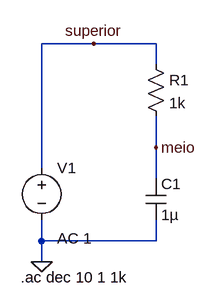
[diagram p0: schematic exemplo 1.asc]
exemplo 1.asc, the LTspice schematic file:
Version 4
SHEET 1 880 680
WIRE 160 -80 80 -80
WIRE 256 -80 160 -80
WIRE 256 -48 256 -80
WIRE 256 80 256 32
WIRE 80 112 80 -80
WIRE 256 128 256 80
WIRE 80 224 80 192
WIRE 256 224 256 192
WIRE 256 224 80 224
WIRE 80 256 80 224
FLAG 80 256 0
FLAG 160 -80 superior
FLAG 256 80 meio
SYMBOL voltage 80 96 R0
WINDOW 123 24 124 Left 2
WINDOW 39 0 0 Left 2
SYMATTR Value2 AC 1
SYMATTR InstName V1
SYMATTR Value ""
SYMBOL res 240 -64 R0
SYMATTR InstName R1
SYMATTR Value 1k
SYMBOL cap 240 128 R0
SYMATTR InstName C1
SYMATTR Value 1µ
TEXT 48 280 Left 2 !.ac dec 10 1 1k

The netlist it stands for:
* exemplo 1.asc
V1 superior 0 AC 1
R1 superior meio 1k
C1 meio 0 1µ
.ac dec 10 1 1k
.backanno
.end

* Results of the author's LTspice run, read from the files saved beside the schematic
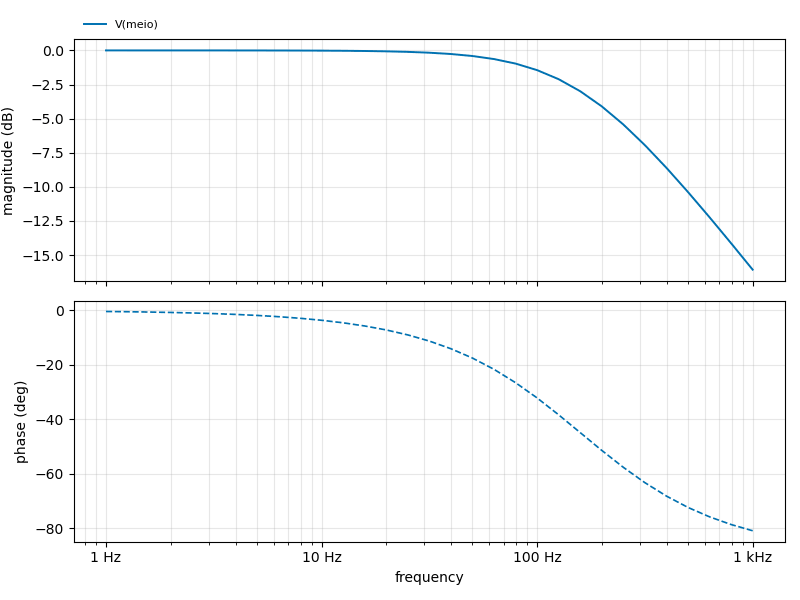
[diagram p1: AC Analysis of exemplo 1.asc, plotted from the saved traces]
* AC Analysis, 1 run:
*   V(meio): -0.00 dB at 1 Hz, -16.07 dB at 1 kHz, peak -0.00 dB at 1 Hz, 3 dB below the peak at 159.1 Hz